# EAGLE design lolin lite (EAGLE 9.6.2)
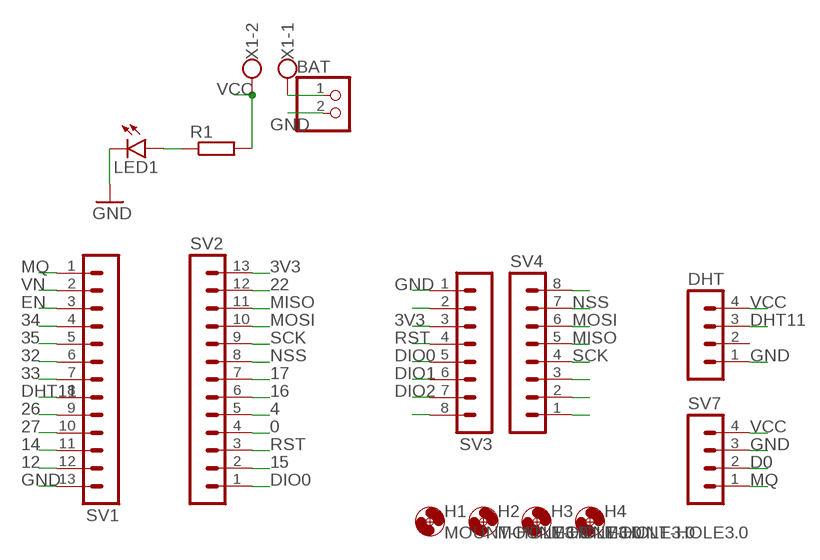
[diagram p0: schematic, sheet 1]

## Parts
BAT  PINHD-1X2  [1X02]
DHT  MA04-1  [MA04-1]
H1  MOUNT-HOLE3.0  [3,0]
H2  MOUNT-HOLE3.0  [3,0]
H3  MOUNT-HOLE3.0  [3,0]
H4  MOUNT-HOLE3.0  [3,0]
LED1  LED5MM  [LED5MM]
R1  R-EU_0309/10  [0309/10]
SV1  MA13-1  [MA13-1]
SV2  MA13-1  [MA13-1]
SV3  MA08-1  [MA08-1]
SV4  MA08-1  [MA08-1]
SV7  MA04-1  [MA04-1]
X1  W237-102  [W237-102]

## Nets
0: SV2.4
3V3: SV2.13 SV3.3
4: SV2.5
12: SV1.12
14: SV1.11
15: SV2.2
16: SV2.6
17: SV2.7
22: SV2.12
26: SV1.9
27: SV1.10
32: SV1.6
33: SV1.7
34: SV1.4
35: SV1.5
D0: SV7.2
DHT11: DHT.3 SV1.8
DIO0: SV2.1 SV3.5
DIO1: SV3.6
DIO2: SV3.7
EN: SV1.3
GND: BAT.2 DHT.1 LED1.K(C) SV1.13 SV3.1 SV7.3
MISO: SV2.11 SV4.5
MOSI: SV2.10 SV4.6
MQ: SV1.1 SV7.1
N$1: LED1.A R1.1
N$2: SV3.2
N$3: BAT.1 X1.1
N$8: SV3.8
N$9: SV4.8
N$14: SV4.3
N$15: SV4.2
N$16: SV4.1
NSS: SV2.8 SV4.7
RST: SV2.3 SV3.4
SCK: SV2.9 SV4.4
VCC: DHT.4 R1.2 SV7.4 X1.2
VN: SV1.2
Unconnected: DHT.2

## Library data of the parts
BAT = pinhead:PINHD-1X2: PIN HEADER
DHT SV7 = con-lstb:MA04-1: PIN HEADER; OC_FARNELL: unknown; OC_NEWARK: unknown
H1-H4 = holes:MOUNT-HOLE: MOUNTING HOLE with drill center marker
LED1 = led:LED: LED OSRAM: - CHIPLED LG R971, LG N971, LY N971, LG Q971, LY Q971, LO R971, LY R971 LH N974, LH R974 LS Q976, LO Q976, LY Q976 LO Q996 - Hyper CHIPLED LW Q18S LB Q993, LB Q99A, LB R99A - SideLED LS A670, LO A670, LY A670, LG A670, LP A670 LB A673, LV A673, LT A673, LW A673 LH A674 LY A675 LS A676, LA A676, LO A676, LY A676, LW A676 LS A679, LY A679, LG A679 - Hyper Micro SIDELED® LS Y876, LA Y876, LO Y876, LY Y876 LT Y87S - SmartLED LW L88C, LW L88S LB L89C, LB L89S, LG L890 LS L89K, LO L89K, LY L89K LS L896, LA L896, LO L896, LY L896 - TOPLED LS T670, LO T670, LY T670, LG T670, LP T670 LSG T670, LSP T670, LSY T670, LOP T670, LYG T670 LG T671, LOG T671, LSG T671 LB T673, LV T673, LT T673, LW T673 LH T674 LS T676, LA T676, LO T676, LY T676, LB T676, LH T676, LSB T676, LW T676 LB T67C, LV T67C, LT T67C, LS T67K, LO T67K, LY T67K, LW E67C LS E67B, LA E67B, LO E67B, LY E67B, LB E67C, LV E67C, LT E67C LW T67C LS T679, LY T679, LG T679 LS T770, LO T770, LY T770, LG T770, LP T770 LB T773, LV T773, LT T773, LW T773 LH T774 LS E675, LA E675, LY E675, LS T675 LS T776, LA T776, LO T776, LY T776, LB T776 LHGB T686 LT T68C, LB T68C - Hyper Mini TOPLED® LB M676 - Mini TOPLED Santana® LG M470 LS M47K, LO M47K, LY M47K Source: http://www.osram.convergy.de LUXEON: - LUMILED® LXK2-PW12-R00, LXK2-PW12-S00, LXK2-PW14-U00, LXK2-PW14-V00 LXK2-PM12-R00, LXK2-PM12-S00, LXK2-PM14-U00 LXK2-PE12-Q00, LXK2-PE12-R00, LXK2-PE12-S00, LXK2-PE14-T00, LXK2-PE14-U00 LXK2-PB12-K00, LXK2-PB12-L00, LXK2-PB12-M00, LXK2-PB14-N00, LXK2-PB14-P00, LXK2-PB14-Q00 LXK2-PR12-L00, LXK2-PR12-M00, LXK2-PR14-Q00, LXK2-PR14-R00 LXK2-PD12-Q00, LXK2-PD12-R00, LXK2-PD12-S00 LXK2-PH12-R00, LXK2-PH12-S00 LXK2-PL12-P00, LXK2-PL12-Q00, LXK2-PL12-R00 Source: www.luxeon.com KINGBRIGHT: KA-3528ASYC Source: www.kingbright.com
R1 = rcl:R-EU_: RESISTOR, European symbol; SPICEPREFIX: R
SV1 SV2 = con-lstb:MA13-1: PIN HEADER; OC_FARNELL: unknown; OC_NEWARK: unknown
SV3 SV4 = con-lstb:MA08-1: PIN HEADER; OC_FARNELL: unknown; OC_NEWARK: unknown
X1 = con-wago-500:W237-102: WAGO SCREW CLAMP; MPN: 237-102; OC_FARNELL: unknown; OC_NEWARK: 70K9898

## Board
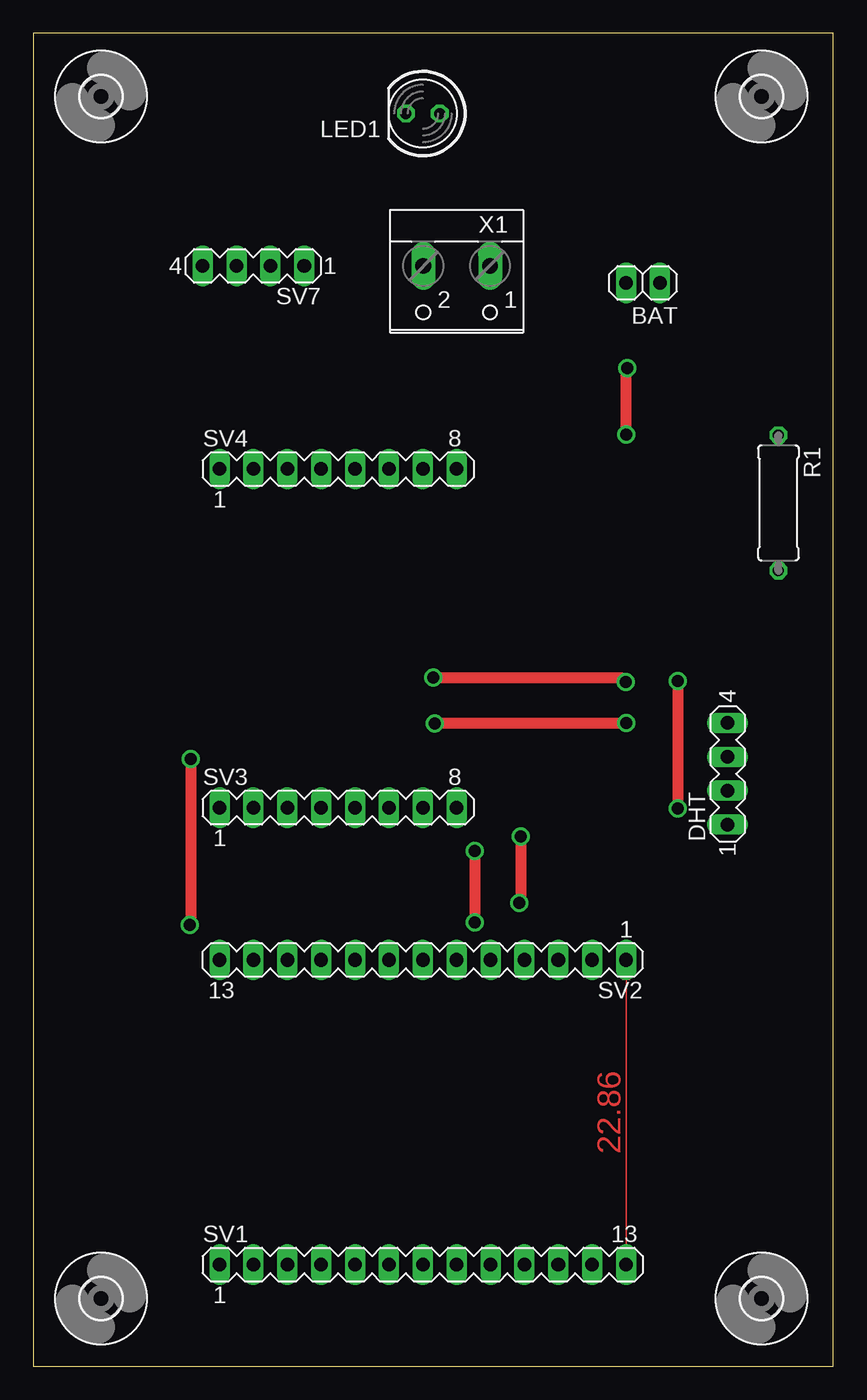
[diagram p1: board, top side]
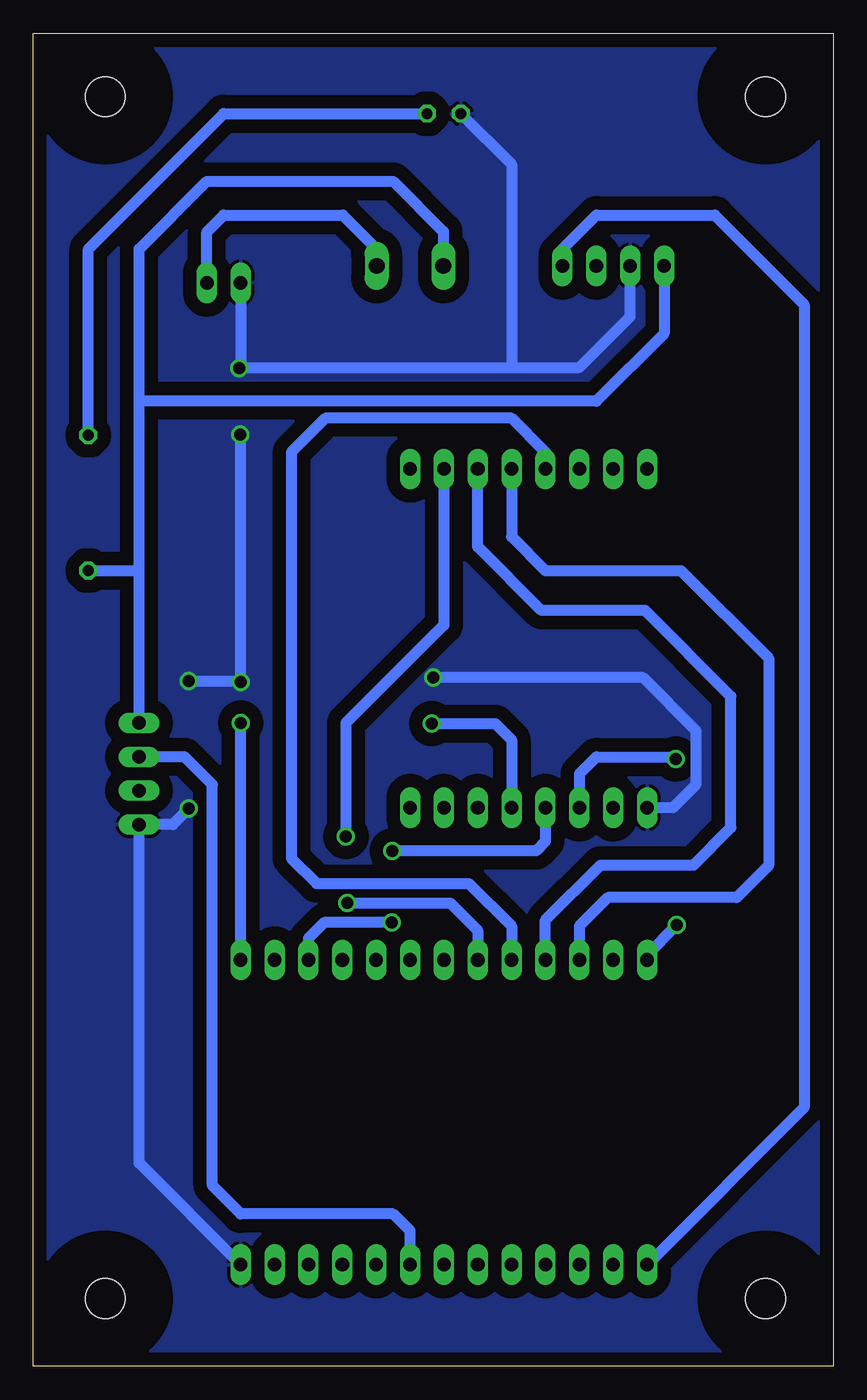
[diagram p2: board, bottom side, seen from below]

Size 60 x 100 mm. Coordinates in mm from the lower left corner, seen from the top.
Outline: 0,0 60,0 60,100 0,100 0,0
Copper layers (1*16): Top 0.035mm / dielectric 1.5mm / Bottom 0.035mm
Design rules "default": minimum track width 6mil, minimum drill 0.35mm, track to track 6mil, track to pad 6mil, pad to pad 6mil, via to via 6mil, smd to smd 6mil, copper to edge 40mil, drill to drill 6mil, minimum pad ring 10mil, minimum via ring 8mil, stop-mask expansion 4mil, vias tented up to drill 0mil, thermal gap 10mil

### Footprints (pad centres in the part's own frame; a part is rotated, then mirrored left to right if it is on the bottom)
1X02 = drill 1.016 long: 1 -1.27,0; 2 1.27,0
MA04-1 = drill 1.016 long: 1 -3.81,0; 2 -1.27,0; 3 1.27,0; 4 3.81,0
3,0 = hole 3: 0,0
LED5MM = drill 0.813 octagon: A -1.27,0; K 1.27,0
0309/10 = drill 0.813 octagon: 1 -5.08,0; 2 5.08,0
MA13-1 = drill 1.016 long: 1 -15.24,0; 2 -12.7,0; 3 -10.16,0; 4 -7.62,0; 5 -5.08,0; 6 -2.54,0; 7 0,0; 8 2.54,0; 9 5.08,0; 10 7.62,0; 11 10.16,0; 12 12.7,0; 13 15.24,0
MA08-1 = drill 1.016 long: 1 -8.89,0; 2 -6.35,0; 3 -3.81,0; 4 -1.27,0; 5 1.27,0; 6 3.81,0; 7 6.35,0; 8 8.89,0
W237-102 = drill 1.194 long: 1 -2.5,-1.27; 2 2.5,-1.27

### Placement (x,y rotation side)
BAT  45.72,81.28 180 top
DHT  52.07,44.45 90 top
H1  5.08,5.08 0 top
H2  54.61,5.08 0 top
H3  54.61,95.25 0 top
H4  5.08,95.25 0 top
LED1  29.21,93.98 180 top
R1  55.88,64.77 270 top
SV1  29.21,7.62 0 top
SV2  29.21,30.48 180 top
SV3  22.86,41.91 0 top
SV4  22.86,67.31 0 top
SV7  16.51,82.55 180 top
X1  31.75,81.28 180 top

### Tracks (layer width: path | path; a pad name or v marks a point on that pad's centre or on a via)
3V3  (via drill 0.9)
  Top 0.813: v11.82,45.57 11.82,33.19 v11.73,33.09
  Bottom 0.813: SV2.13 13.97,30.85 v11.73,33.09 | v11.82,45.57 11.97,45.72 17.78,45.72 19.05,44.45 SV3.3
DHT11
  Bottom 0.813: SV1.8 31.75,10.16 33.02,11.43 44.45,11.43 46.57,13.55 46.57,43.63 48.66,45.72 DHT.3
DIO0  (via drill 0.9)
  Top 0.813: v44.45,48.26 44.41,48.22 v30.12,48.22
  Bottom 0.813: SV2.1 v44.45,48.26 | v30.12,48.22 25.36,48.22 24.13,46.99 SV3.5
GND  (via drill 0.9)
  Top 0.813: v30,51.66 44.1,51.66 v44.44,51.32 | v44.48,69.9 44.48,74.8 v44.56,74.88 | v48.34,51.4 v48.34,41.83
  Bottom 0.813: SV1.13 52.07,15.24 DHT.1 49.53,40.64 v48.34,41.83 | SV7.3 15.24,78.74 19.05,74.93 24.13,74.93 | 44.45,74.93 44.52,74.93 44.56,74.89 v44.56,74.88 | 44.45,74.93 24.13,74.93 | SV3.1 12.02,41.91 10.28,43.65 10.28,47.67 14.27,51.66 v30,51.66 | v44.44,51.32 44.44,69.86 v44.48,69.9 | BAT.2 44.45,74.93 | 44.47,51.29 v44.44,51.32 | v44.44,51.32 44.52,51.4 v48.34,51.4 | 24.13,74.93 24.13,90.17 LED1.K
  pour Bottom (isolate 1.016): 0,100.33 0,0 59.69,0 59.69,100.33
MISO
  Bottom 0.813: SV4.5 24.13,62.23 21.59,59.69 11.43,59.69 4.85,53.11 4.85,37.56 7.26,35.15 16.92,35.15 19.05,33.02 SV2.11
MOSI
  Bottom 0.813: SV2.10 21.59,33.48 17.46,37.6 10.48,37.6 7.68,40.41 7.68,50.26 14.12,56.7 21.89,56.7 26.67,61.48 SV4.6
MQ
  Bottom 0.813: SV7.1 20.32,83.82 17.78,86.36 8.89,86.36 2.19,79.66 2.19,19.41 SV1.1
N$1
  Bottom 0.813: R1.1 55.88,83.82 45.72,93.98 LED1.A
N$3
  Bottom 0.813: BAT.1 46.99,85.09 45.72,86.36 36.79,86.36 34.25,83.82 X1.1
NSS  (via drill 0.9)
  Top 0.813: v36.55,39.74 36.55,34.86 v36.45,34.75
  Bottom 0.813: SV4.7 29.21,55.6 36.55,48.26 v36.55,39.74 | SV2.8 26.67,32.71 28.72,34.75 v36.45,34.75
RST  (via drill 0.9)
  Top 0.813: v33.1,38.67 33.11,38.65 v33.11,33.29
  Bottom 0.813: SV3.4 21.59,39.37 22.29,38.67 v33.1,38.67 | v33.11,33.29 38.19,33.29 39.37,32.11 SV2.3
SCK
  Bottom 0.813: SV4.4 21.59,68.58 24.13,71.12 38.1,71.12 40.64,68.58 40.64,38.1 38.76,36.22 27.33,36.22 24.13,33.02 SV2.9
VCC
  Bottom 0.813: DHT.4 52.07,59.69 | 52.07,59.69 52.07,72.39 | 52.07,72.39 52.07,83.82 46.99,88.9 33.02,88.9 29.25,85.13 X1.2 | SV7.4 12.7,77.47 17.78,72.39 52.07,72.39 | R1.2 52.07,59.69
(copper drawn outside any net)
  shapes: Top area x1